# EAGLE design ninja-relay (EAGLE 6.4)
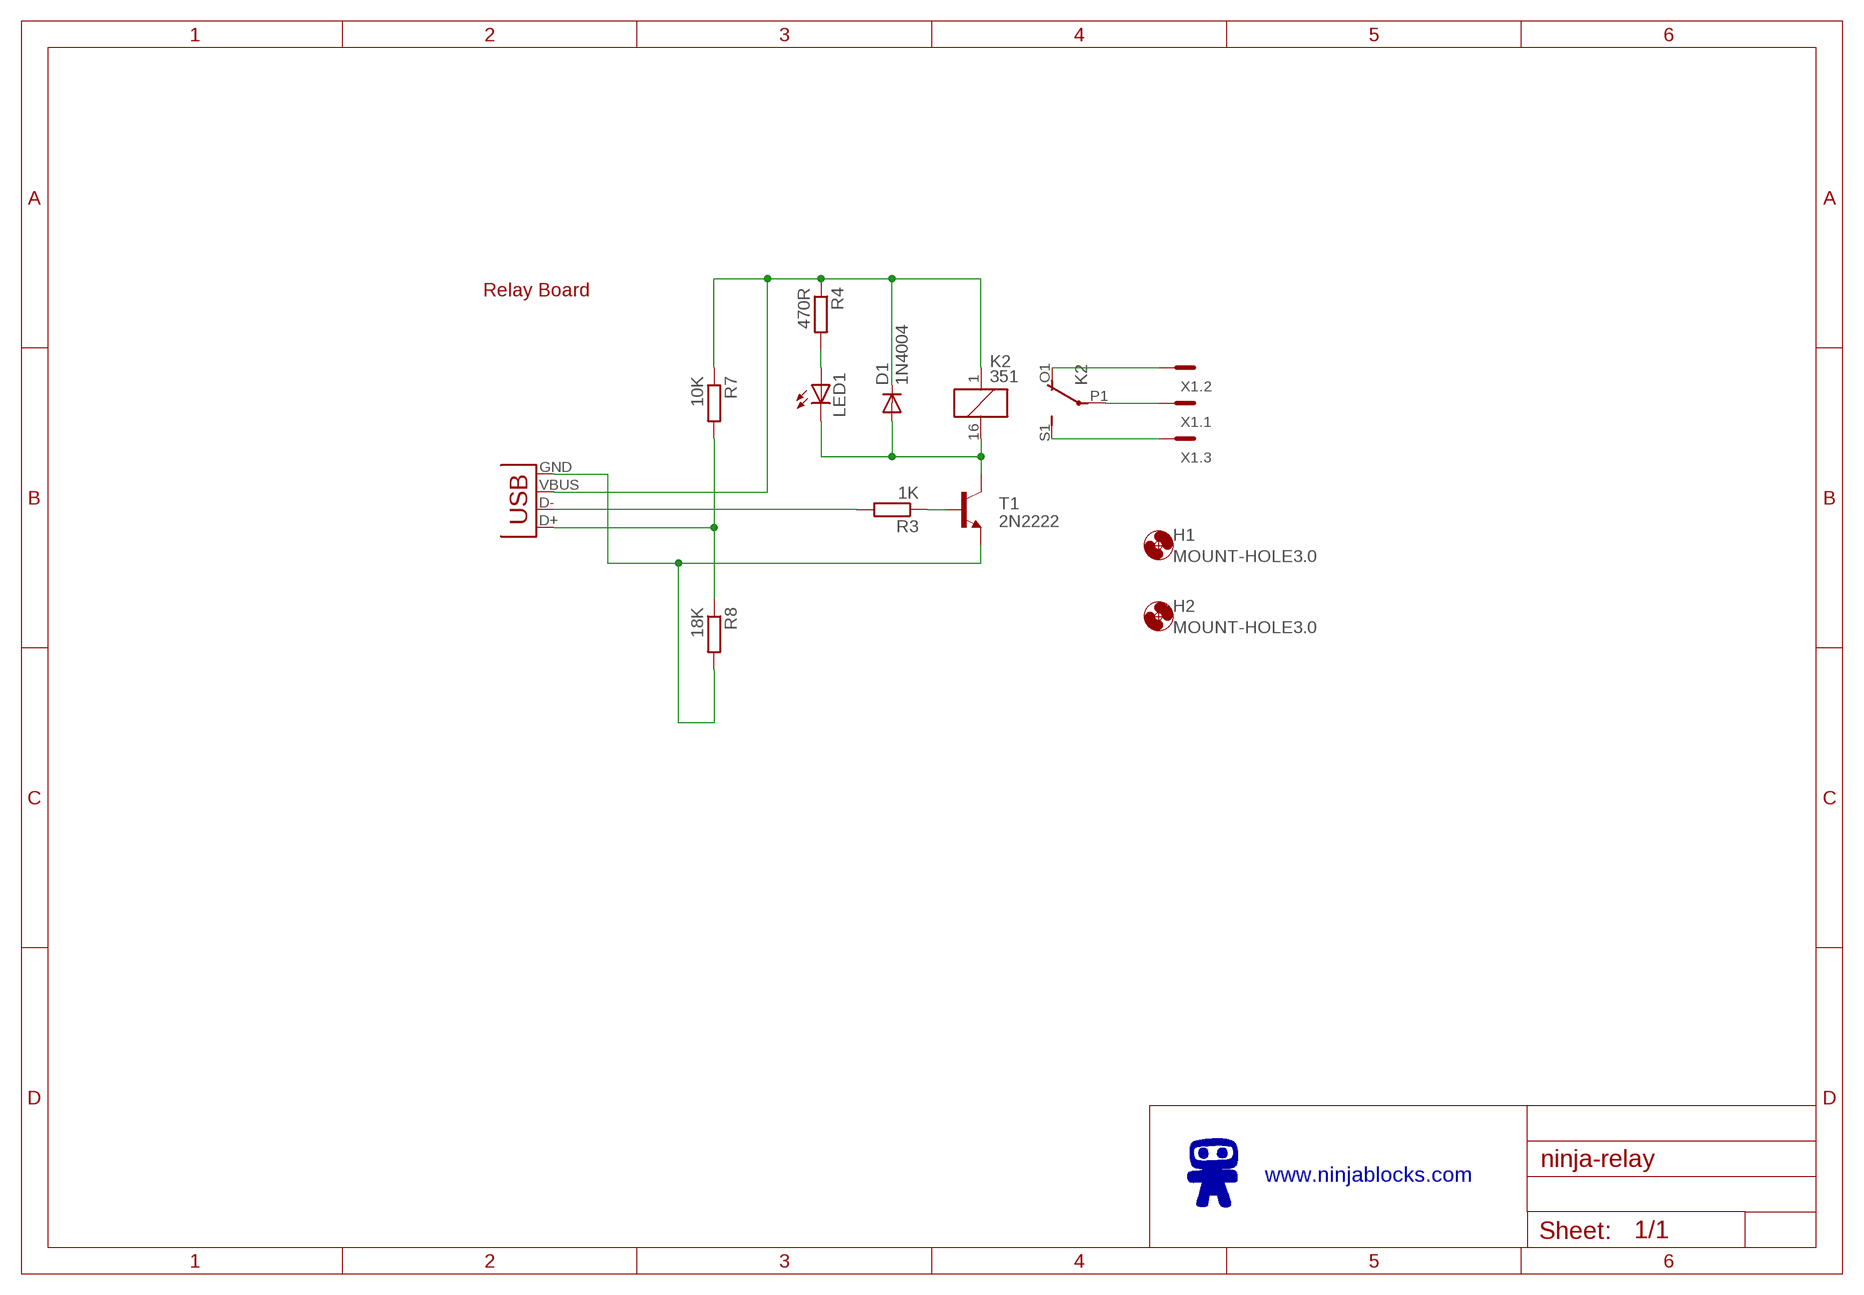
[diagram p0: schematic, sheet 1]

## Parts
D1  1N4004  [DO41-10]
H1  MOUNT-HOLE3.0  [3,0]
H2  MOUNT-HOLE3.0  [3,0]
K2  351  [351]
LED1  LED3MM  [LED3MM]
R3  1K  R-EU_0207/10  [0207/10]
R4  470R  R-EU_0207/10  [0207/10]
R7  10K  R-EU_0207/10  [0207/10]
R8  18K  R-EU_0207/10  [0207/10]
T1  2N2222  [TO92-EBC-OVAL]
X1  MC3  [MC3]
X2  USB-A-H  [USB-A-H]

## Nets
GND: R8.2 T1.E X2.GND
N$1: K2.O1(2:O) X1.2
N$2: K2.P1(2:P) X1.1
N$3: K2.S1(2:S) X1.3
N$254: D1.A K2.16 LED1.K(C) T1.C
N$278: D1.C K2.1 R4.1 R7.1 X2.VBUS
N$279: R3.1 T1.B
N$280: R3.2 X2.D-
N$281: LED1.A R4.2
N$284: R7.2 R8.1 X2.D+
Unconnected: K2.O2(3:O) K2.P2(3:P) K2.S2(3:S)

## Notes on the sheet
- Relay Board
- www.ninjablocks.com

## Library data of the parts
D1 = adafruit:1N4004: DIODE General purpose 1N400x type rectifier (With bigger pads) http://www.ladyada.net/library/pcb/eaglelibrary.html
H1 H2 = holes:MOUNT-HOLE: MOUNTING HOLE with drill center marker
K2 = relay:351: RELAY 2 x switch, Omron; OC_FARNELL: unknown; OC_NEWARK: unknown
LED1 = adafruit:LED: LED OSRAM: - CHIPLED LG R971, LG N971, LY N971, LG Q971, LY Q971, LO R971, LY R971 LH N974, LH R974 LS Q976, LO Q976, LY Q976 LO Q996 - Hyper CHIPLED LW Q18S LB Q993, LB Q99A, LB R99A - SideLED LS A670, LO A670, LY A670, LG A670, LP A670 LB A673, LV A673, LT A673, LW A673 LH A674 LY A675 LS A676, LA A676, LO A676, LY A676, LW A676 LS A679, LY A679, LG A679 - Hyper Micro SIDELED® LS Y876, LA Y876, LO Y876, LY Y876 LT Y87S - SmartLED LW L88C, LW L88S LB L89C, LB L89S, LG L890 LS L89K, LO L89K, LY L89K LS L896, LA L896, LO L896, LY L896 - TOPLED LS T670, LO T670, LY T670, LG T670, LP T670 LSG T670, LSP T670, LSY T670, LOP T670, LYG T670 LG T671, LOG T671, LSG T671 LB T673, LV T673, LT T673, LW T673 LH T674 LS T676, LA T676, LO T676, LY T676, LB T676, LH T676, LSB T676, LW T676 LB T67C, LV T67C, LT T67C, LS T67K, LO T67K, LY T67K, LW E67C LS E67B, LA E67B, LO E67B, LY E67B, LB E67C, LV E67C, LT E67C LW T67C LS T679, LY T679, LG T679 LS T770, LO T770, LY T770, LG T770, LP T770 LB T773, LV T773, LT T773, LW T773 LH T774 LS E675, LA E675, LY E675, LS T675 LS T776, LA T776, LO T776, LY T776, LB T776 LHGB T686 LT T68C, LB T68C - Hyper Mini TOPLED® LB M676 - Mini TOPLED Santana® LG M470 LS M47K, LO M47K, LY M47K Source: http://www.osram.convergy.de/
R3 R4 R7 R8 = resistor:R-EU_: RESISTOR, European symbol
T1 = adafruit:2N2222: NPN TRANSISTOR Big oval pads
X1 = con-phoenix-381_l:MC3: Mini-Combicon 3.81mm horizontal 3-polig (ohne Gegenstecker)
X2 = con-usb:USB: USB Connectors

## Net classes
0 default: clearance 0.355 mm

## Board
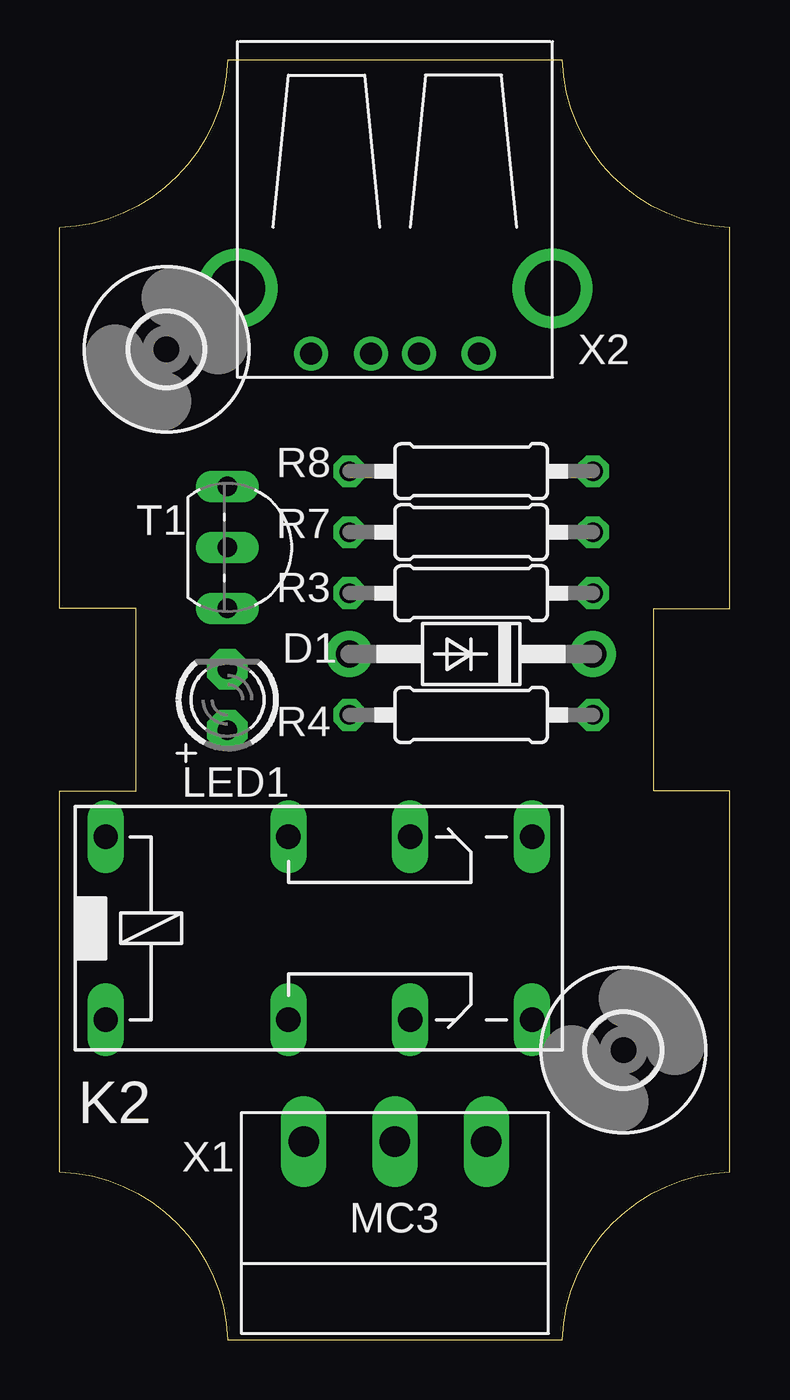
[diagram p1: board, top side]
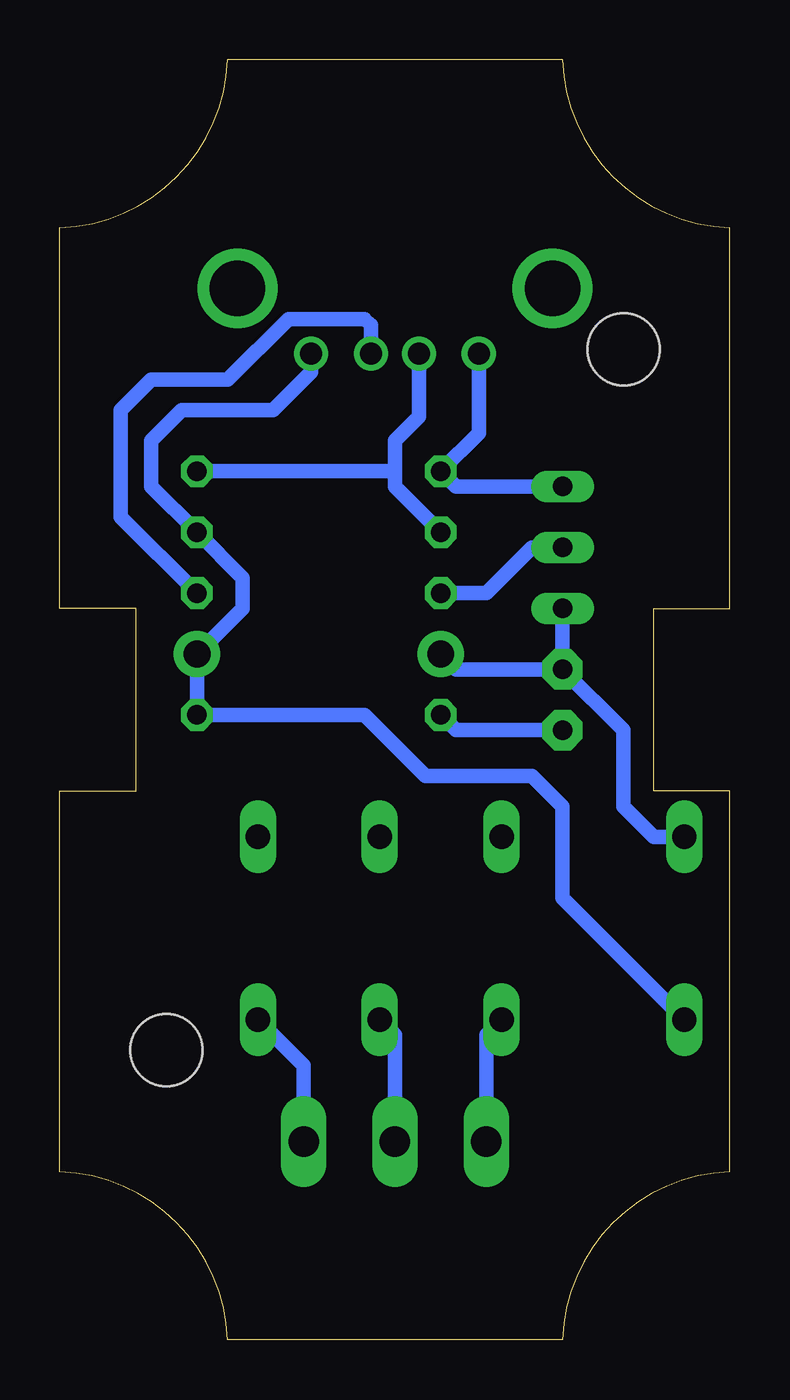
[diagram p2: board, bottom side, seen from below]

Size 27.94 x 53.34 mm. Coordinates in mm from the lower left corner, seen from the top.
Outline: 6.98,0 20.95,0 arc-86 27.94,6.98 27.94,22.86 24.77,22.86 24.77,30.48 27.94,30.48 27.94,46.36 arc-86 20.95,53.34 6.98,53.34 arc-86 0,46.36 0,30.48 3.17,30.48 3.17,22.86 0,22.86 0,6.98 arc-86 6.98,0
Copper layers (1*16): Top 0.035mm / dielectric 1.5mm / Bottom 0.035mm
Design rules "default": minimum track width 10mil, minimum drill 24mil, track to track 8mil, track to pad 8mil, pad to pad 8mil, via to via 8mil, smd to smd 8mil, copper to edge 40mil, drill to drill 8mil, minimum pad ring 10mil, minimum via ring 8mil, stop-mask expansion 4mil, vias tented up to drill 0mil, thermal gap 10mil

### Footprints (pad centres in the part's own frame; a part is rotated, then mirrored left to right if it is on the bottom)
DO41-10 = drill 1.118 pad 1.93: A 5.08,0; C -5.08,0
3,0 = hole 3: 0,0
351 = drill 1.016 long: 1 -3.81,-3.81; 16 -3.81,3.81; O1 8.89,-3.81; O2 8.89,3.81; P1 3.81,-3.81; P2 3.81,3.81; S1 13.97,-3.81; S2 13.97,3.81
LED3MM = drill 0.813 pad 1.676 octagon: A -1.27,0; K 1.27,0
0207/10 = drill 0.813 octagon: 1 -5.08,0; 2 5.08,0
TO92-EBC-OVAL = drill 0.813 long: B 0,-1.27; C 2.54,-1.27; E -2.54,-1.27
MC3 = drill 1.27 long: 1 -3.81,0; 2 0,0; 3 3.81,0
USB-A-H = drill 0.914: D+ 2.718,-1.003; D- 2.718,1.003; GND 2.718,-3.493; VBUS 2.718,3.493 | drill 2.311: P$5 0,-6.566; P$6 0,6.566

### Placement (x,y rotation side)
D1  17.14,28.57 180 top
H1  23.5,12.06 0 top
H2  4.45,41.28 0 top
K2  5.71,17.14 0 top
LED1  6.98,26.67 90 top
R3  17.14,31.11 0 top
R4  17.14,26.04 180 top
R7  17.14,33.66 180 top
R8  17.14,36.2 180 top
T1  8.26,33.02 270 top
X1  13.97,8.26 0 top
X2  13.97,43.82 270 top

### Tracks (layer width: path | path; a pad name or v marks a point on that pad's centre or on a via)
GND
  Bottom 0.61: T1.E 11.43,35.56 R8.2 10.48,37.78 X2.GND
N$1
  Bottom 0.61: X1.2 13.97,12.7 K2.O1
N$2
  Bottom 0.61: X1.1 10.16,12.7 K2.P1
N$3
  Bottom 0.61: X1.3 17.78,11.43 K2.S1
N$254
  Bottom 0.61: T1.C LED1.K | LED1.K 11.43,27.94 D1.A | K2.16 3.17,20.95 4.45,22.22 4.45,25.4 LED1.K
N$278
  Bottom 0.61: X2.VBUS 17.46,40.32 19.05,38.74 22.86,38.74 24.13,37.47 24.13,35.56 R7.1 20.32,31.75 20.32,30.48 D1.C R4.1 15.24,26.04 12.7,23.5 8.26,23.5 6.98,22.22 6.98,18.41 K2.1
N$279
  Bottom 0.61: T1.B 8.26,33.02 10.16,31.11 R3.1
N$280
  Bottom 0.61: X2.D- 14.97,42.28 15.24,42.55 18.41,42.55 20.95,40.01 24.13,40.01 25.4,38.74 25.4,34.29 R3.2
N$281
  Bottom 0.61: LED1.A 11.43,25.4 R4.2
N$284
  Bottom 0.61: X2.D+ 12.97,38.47 13.97,37.47 13.97,36.2 | 13.97,36.2 13.97,35.56 R7.2 | R8.1 13.97,36.2

### Text on the board
DrillLegend_01-16: 01-16
DrillLegend_01-20: 01-20